# EAGLE schematic EXT_3N (EAGLE 6.4)
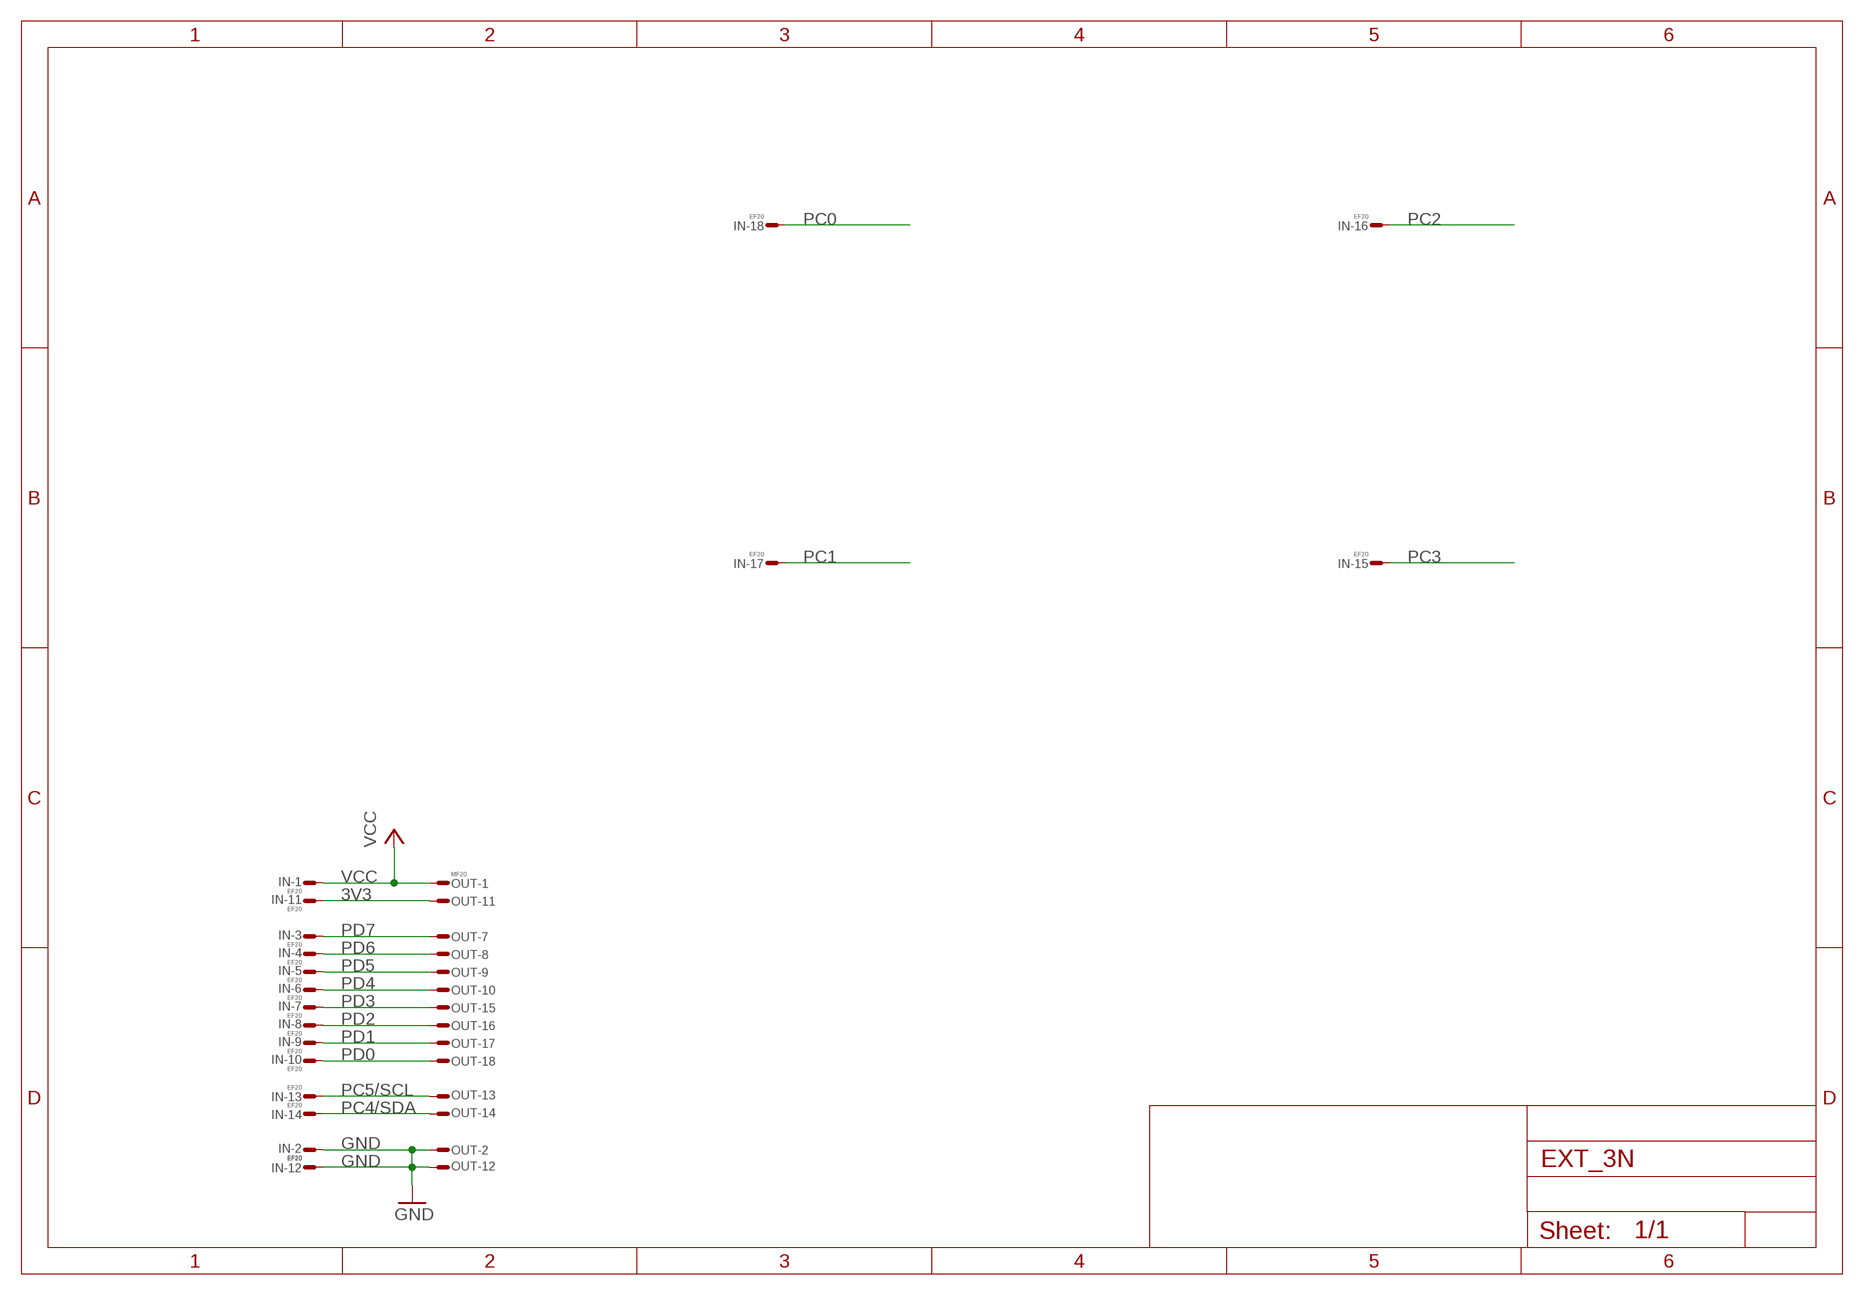
[diagram p0: schematic, sheet 1]

## Parts
IN  EF20  FE20ELS  [FE10-2WS]
OUT  MF20  ML20LSE  [ML20LS]

## Nets
3V3: IN.P$11 OUT.P$11
GND: IN.P$2 IN.P$12 OUT.P$2 OUT.P$12
PC0: IN.P$18
PC1: IN.P$17
PC2: IN.P$16
PC3: IN.P$15
PC4/SDA: IN.P$14 OUT.P$14
PC5/SCL: IN.P$13 OUT.P$13
PD0: IN.P$10 OUT.P$18
PD1: IN.P$9 OUT.P$17
PD2: IN.P$8 OUT.P$16
PD3: IN.P$7 OUT.P$15
PD4: IN.P$6 OUT.P$10
PD5: IN.P$5 OUT.P$9
PD6: IN.P$4 OUT.P$8
PD7: IN.P$3 OUT.P$7
VCC: IN.P$1 OUT.P$1
Unconnected: IN.P$19 IN.P$20 OUT.P$3 OUT.P$4 OUT.P$5 OUT.P$6 OUT.P$19 OUT.P$20

## Library data of the parts
IN = Conn:FE20E
OUT = Conn:ML20?E: HARTING